# Altium schematic sheet Sch_FindeCarrera.SchDoc: Control de Domótica
size A4; Author: Francisco González González - Eugenia Ipar; CompanyName: Control de los Fines de Carrera; DocumentNumber: 6; SheetNumber: 6; SheetTotal: 12; Materia: Técnicas Digitales II; Year: 2015; Placa: Sensores Fines de Carrera; Prof1: Prof: Alarcón, Juan; Prof2: Ayud: Crivelli, Montalti; Prof3: Ayud: Montalti, Pablo; PageSetup: Record=PageOptions|CenterHorizontal=True|CenterVertical=True|PrintScale=1.00|XCorrection=1.00|YCorrection=1.00|PrintKind=0|BorderSize=5000000|LeftOffset=0|BottomOffset=0|Orientation=2|PaperLength=1000|PaperWidth=1000|Scale=100|PaperSource=7|PrintQuality=-3|MediaType=1|DitherType=10|PrintScaleMode=1|PaperKind=A4|PaperIndex=9
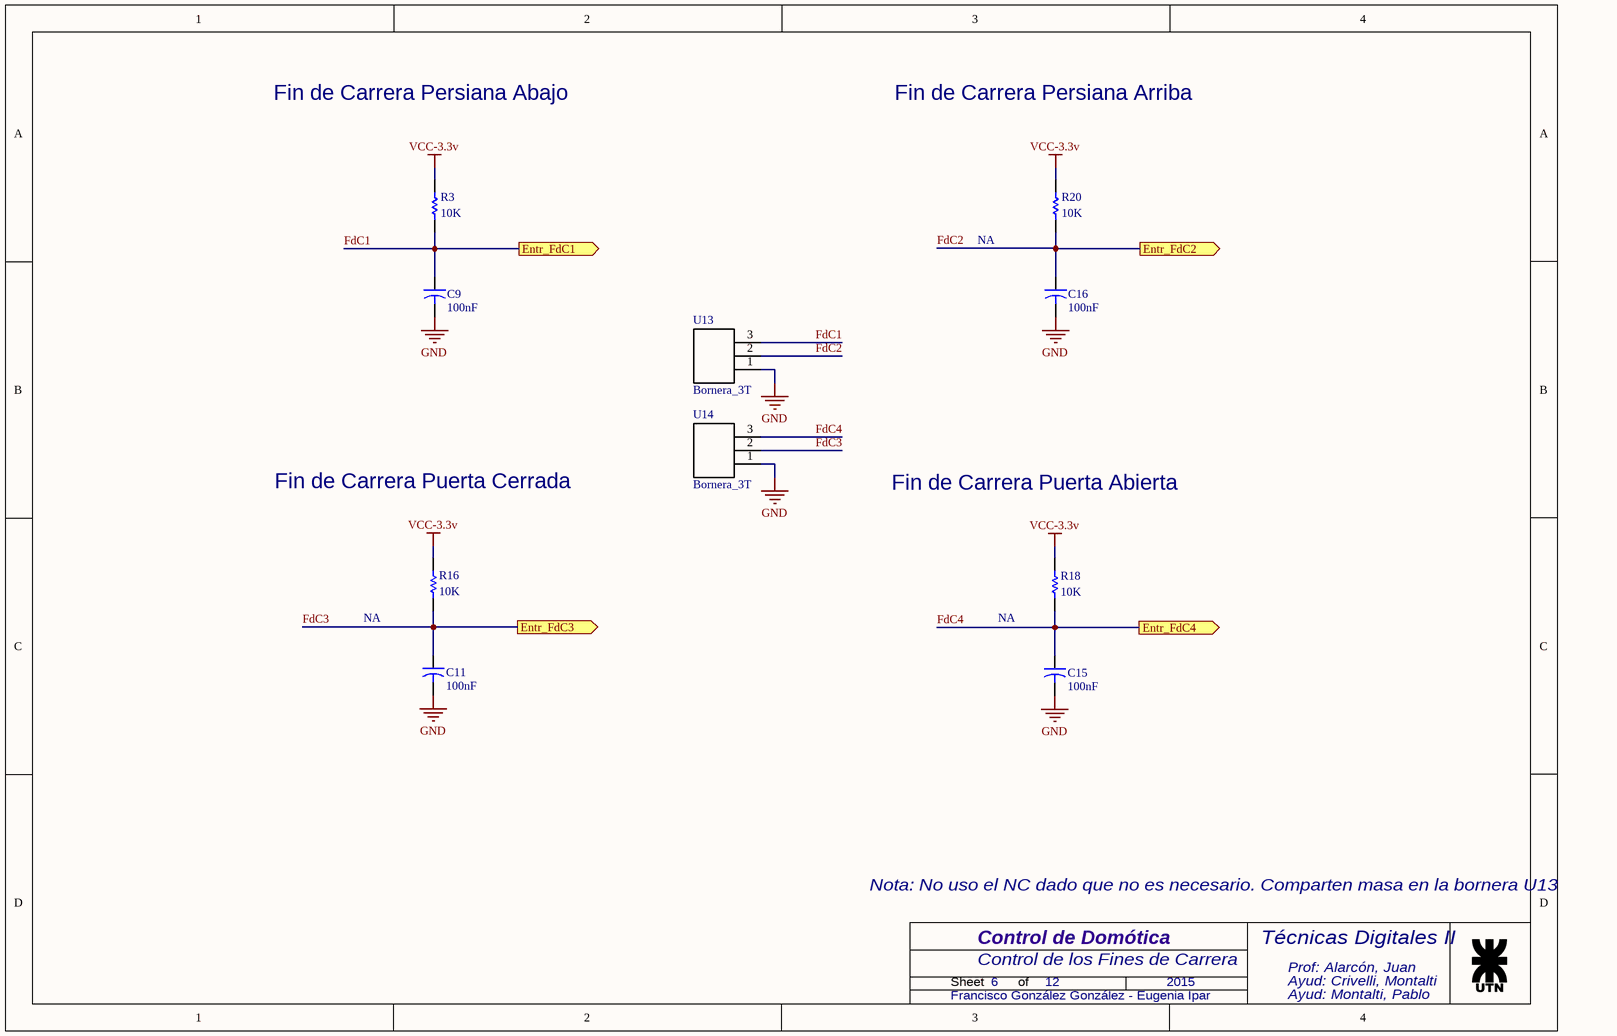
[diagram p0: Sch_FindeCarrera.SchDoc]

## Parts
C9  value 100nF  [CAPR5-4X5]  (hidden comment: Cap2)
C11  value 100nF  [CAPR5-4X5]  (hidden comment: Cap2)
C15  value 100nF  [CAPR5-4X5]  (hidden comment: Cap2)
C16  value 100nF  [CAPR5-4X5]  (hidden comment: Cap2)
R3  value 10K  [AXIAL-0.3]  (hidden comment: Res1)
R16  value 10K  [AXIAL-0.3]  (hidden comment: Res1)
R18  value 10K  [AXIAL-0.3]  (hidden comment: Res1)
R20  value 10K  [AXIAL-0.3]  (hidden comment: Res1)
U13  Bornera_3T  [BORNERA_3]
U14  Bornera_3T  [BORNERA_3]

## Ports
Entr_FdC1 (out), Entr_FdC2 (out), Entr_FdC3 (out), Entr_FdC4 (out)

## Nets
GND: C9.2 C11.2 C15.2 C16.2 U13.1 U14.1
VCC-3.3v: R3.2 R16.2 R18.2 R20.2
FdC1: C9.1 R3.1 U13.3 ; port Entr_FdC1
FdC2: C16.1 R20.1 U13.2 ; port Entr_FdC2
FdC3: C11.1 R16.1 U14.2 ; port Entr_FdC3
FdC4: C15.1 R18.1 U14.3 ; port Entr_FdC4

## Notes on the sheet
- Fin de Carrera Persiana Abajo
- Fin de Carrera Persiana Arriba
- NA
- Fin de Carrera Puerta Cerrada
- Fin de Carrera Puerta Abierta
- Nota: No uso el NC dado que no es necesario. Comparten masa en la bornera U13
- Sheet
- of

## Library data of the parts
C9 C11 C15 C16 = Cap2: Capacitor; Published: 23-Sep-2002; PackageReference: CAPR5-4X5; Publisher: Altium Limited; PackageDescription: Capacitor; 2 Leads
R3 R16 R18 R20 = Res1: Resistor; Published: 8-Jun-2000; LatestRevisionDate: 17-Jul-2002; LatestRevisionNote: Re-released for DXP Platform.; PackageReference: AXIAL-0.3; Publisher: Altium Limited; PackageDescription: Axial Device, Thru-Hole; 2 Leads; 0.3 in Pin Spacing
U13 U14 = Bornera_3T: Bornera de 3 Terminales Pitch 5mm